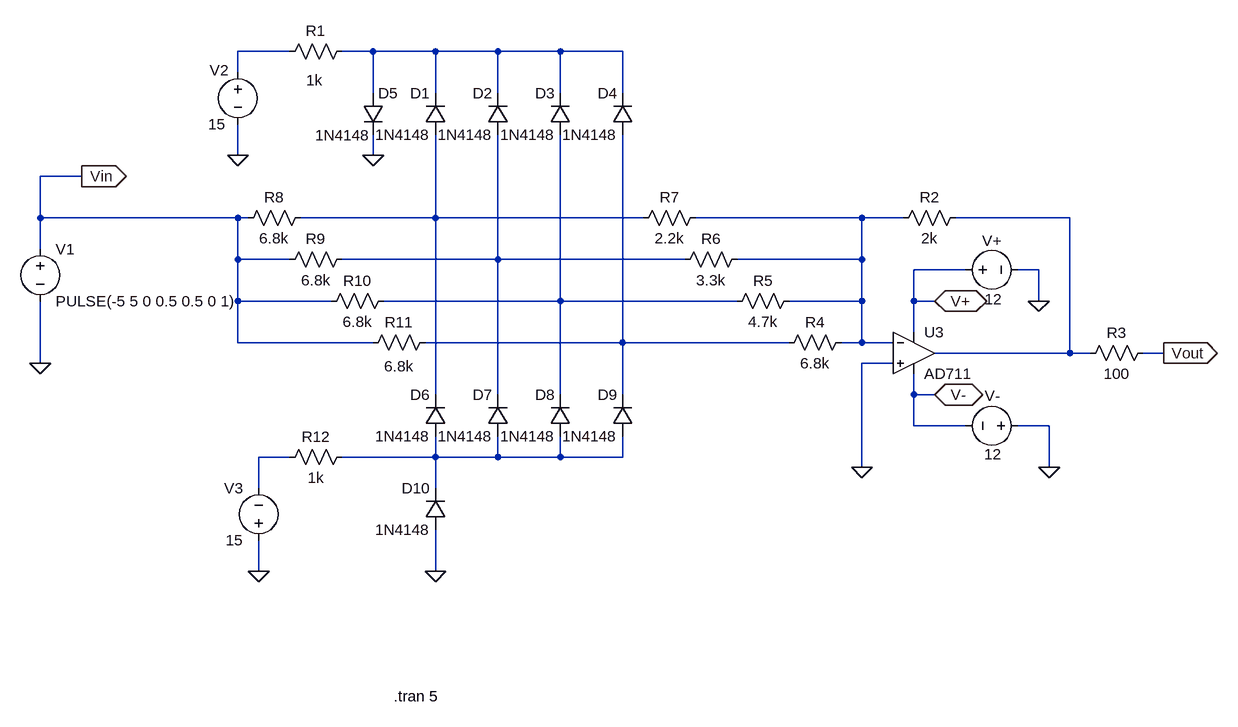
[diagram p0: schematic Ejercicio_3(Conversor_triangular_senoidal).asc]
Ejercicio_3(Conversor_triangular_senoidal).asc, the LTspice schematic file:
Version 4
SHEET 1 1432 776
WIRE -1008 -272 -1088 -272
WIRE -880 -272 -928 -272
WIRE -784 -272 -880 -272
WIRE -688 -272 -784 -272
WIRE -592 -272 -688 -272
WIRE -496 -272 -592 -272
WIRE -1088 -240 -1088 -272
WIRE -880 -208 -880 -272
WIRE -784 -208 -784 -272
WIRE -688 -208 -688 -272
WIRE -592 -208 -592 -272
WIRE -496 -208 -496 -272
WIRE -1088 -112 -1088 -160
WIRE -880 -112 -880 -144
WIRE -1328 -80 -1392 -80
WIRE -1392 -16 -1392 -80
WIRE -1088 -16 -1392 -16
WIRE -1072 -16 -1088 -16
WIRE -784 -16 -784 -144
WIRE -784 -16 -992 -16
WIRE -464 -16 -784 -16
WIRE -128 -16 -384 -16
WIRE -64 -16 -128 -16
WIRE 192 -16 16 -16
WIRE -1392 32 -1392 -16
WIRE -1088 48 -1088 -16
WIRE -1008 48 -1088 48
WIRE -688 48 -688 -144
WIRE -688 48 -928 48
WIRE -400 48 -688 48
WIRE -128 48 -128 -16
WIRE -128 48 -320 48
WIRE 32 64 -48 64
WIRE 144 64 112 64
WIRE -1088 112 -1088 48
WIRE -944 112 -1088 112
WIRE -592 112 -592 -144
WIRE -592 112 -864 112
WIRE -320 112 -592 112
WIRE -128 112 -128 48
WIRE -128 112 -240 112
WIRE -48 112 -48 64
WIRE -16 112 -48 112
WIRE 144 112 144 64
WIRE -48 160 -48 112
WIRE -1088 176 -1088 112
WIRE -880 176 -1088 176
WIRE -496 176 -496 -144
WIRE -496 176 -800 176
WIRE -240 176 -496 176
WIRE -128 176 -128 112
WIRE -128 176 -160 176
WIRE -80 176 -128 176
WIRE 192 192 192 -16
WIRE 192 192 -16 192
WIRE 224 192 192 192
WIRE 336 192 304 192
WIRE -1392 208 -1392 112
WIRE -80 208 -128 208
WIRE -784 256 -784 -16
WIRE -688 256 -688 48
WIRE -592 256 -592 112
WIRE -496 256 -496 176
WIRE -48 256 -48 224
WIRE -16 256 -48 256
WIRE -48 304 -48 256
WIRE 32 304 -48 304
WIRE 160 304 112 304
WIRE -1008 352 -1056 352
WIRE -784 352 -784 320
WIRE -784 352 -928 352
WIRE -688 352 -688 320
WIRE -688 352 -784 352
WIRE -592 352 -592 320
WIRE -592 352 -688 352
WIRE -496 352 -496 320
WIRE -496 352 -592 352
WIRE -128 368 -128 208
WIRE 160 368 160 304
WIRE -1056 400 -1056 352
WIRE -784 400 -784 352
WIRE -1056 528 -1056 480
WIRE -784 528 -784 464
FLAG -1392 208 0
FLAG 144 112 0
FLAG 160 368 0
FLAG 336 192 Vout
IOPIN 336 192 Out
FLAG -128 368 0
FLAG -1328 -80 Vin
IOPIN -1328 -80 Out
FLAG -1088 -112 0
FLAG -1056 528 0
FLAG -880 -112 0
FLAG -784 528 0
FLAG -16 112 V+
IOPIN -16 112 BiDir
FLAG -16 256 V-
IOPIN -16 256 BiDir
SYMBOL res -912 -288 R90
WINDOW 0 0 56 VBottom 2
WINDOW 3 45 58 VTop 2
SYMATTR InstName R1
SYMATTR Value 1k
SYMBOL res 32 -32 R90
WINDOW 0 0 56 VBottom 2
WINDOW 3 32 56 VTop 2
SYMATTR InstName R2
SYMATTR Value 2k
SYMBOL diode -768 -144 R180
WINDOW 0 24 64 Left 2
WINDOW 3 24 0 Left 2
SYMATTR InstName D1
SYMATTR Value 1N4148
SYMBOL diode -672 -144 R180
WINDOW 0 24 64 Left 2
WINDOW 3 24 0 Left 2
SYMATTR InstName D2
SYMATTR Value 1N4148
SYMBOL voltage 16 64 R270
WINDOW 123 0 0 Left 0
WINDOW 39 0 0 Left 0
WINDOW 0 45 41 VRight 2
WINDOW 3 -45 45 VRight 2
SYMATTR InstName V+
SYMATTR Value 12
SYMBOL voltage 128 304 R90
WINDOW 0 -46 43 VRight 2
WINDOW 3 44 41 VRight 2
WINDOW 123 0 0 Left 0
WINDOW 39 0 0 Left 0
SYMATTR InstName V-
SYMATTR Value 12
SYMBOL voltage -1392 16 R0
WINDOW 123 0 0 Left 0
WINDOW 39 0 0 Left 0
SYMATTR InstName V1
SYMATTR Value PULSE(-5 5 0 0.5 0.5 0 1)
SYMBOL res 320 176 R90
WINDOW 0 0 56 VBottom 2
WINDOW 3 32 56 VTop 2
SYMATTR InstName R3
SYMATTR Value 100
SYMBOL res -144 160 R90
WINDOW 0 0 56 VBottom 2
WINDOW 3 32 56 VTop 2
SYMATTR InstName R4
SYMATTR Value 6.8k
SYMBOL res -224 96 R90
WINDOW 0 0 56 VBottom 2
WINDOW 3 32 56 VTop 2
SYMATTR InstName R5
SYMATTR Value 4.7k
SYMBOL res -304 32 R90
WINDOW 0 0 56 VBottom 2
WINDOW 3 32 56 VTop 2
SYMATTR InstName R6
SYMATTR Value 3.3k
SYMBOL res -368 -32 R90
WINDOW 0 0 56 VBottom 2
WINDOW 3 32 56 VTop 2
SYMATTR InstName R7
SYMATTR Value 2.2k
SYMBOL res -976 -32 R90
WINDOW 0 0 56 VBottom 2
WINDOW 3 32 56 VTop 2
SYMATTR InstName R8
SYMATTR Value 6.8k
SYMBOL res -912 32 R90
WINDOW 0 0 56 VBottom 2
WINDOW 3 32 56 VTop 2
SYMATTR InstName R9
SYMATTR Value 6.8k
SYMBOL res -848 96 R90
WINDOW 0 0 56 VBottom 2
WINDOW 3 32 56 VTop 2
SYMATTR InstName R10
SYMATTR Value 6.8k
SYMBOL res -784 160 R90
WINDOW 0 0 56 VBottom 2
WINDOW 3 37 56 VTop 2
SYMATTR InstName R11
SYMATTR Value 6.8k
SYMBOL res -912 336 R90
WINDOW 0 0 56 VBottom 2
WINDOW 3 32 56 VTop 2
SYMATTR InstName R12
SYMATTR Value 1k
SYMBOL voltage -1088 -256 R0
WINDOW 123 0 0 Left 0
WINDOW 39 0 0 Left 0
WINDOW 0 -43 13 Left 2
WINDOW 3 -46 96 Left 2
SYMATTR InstName V2
SYMATTR Value 15
SYMBOL voltage -1056 496 R180
WINDOW 0 24 96 Left 2
WINDOW 3 24 16 Left 2
WINDOW 123 0 0 Left 0
WINDOW 39 0 0 Left 0
SYMATTR InstName V3
SYMATTR Value 15
SYMBOL diode -576 -144 R180
WINDOW 0 24 64 Left 2
WINDOW 3 24 0 Left 2
SYMATTR InstName D3
SYMATTR Value 1N4148
SYMBOL diode -480 -144 R180
WINDOW 0 24 64 Left 2
WINDOW 3 24 0 Left 2
SYMATTR InstName D4
SYMATTR Value 1N4148
SYMBOL diode -896 -208 R0
WINDOW 3 -73 65 Left 2
SYMATTR Value 1N4148
SYMATTR InstName D5
SYMBOL diode -768 320 R180
WINDOW 0 24 64 Left 2
WINDOW 3 24 0 Left 2
SYMATTR InstName D6
SYMATTR Value 1N4148
SYMBOL diode -672 320 R180
WINDOW 0 24 64 Left 2
WINDOW 3 24 0 Left 2
SYMATTR InstName D7
SYMATTR Value 1N4148
SYMBOL diode -576 320 R180
WINDOW 0 24 64 Left 2
WINDOW 3 24 0 Left 2
SYMATTR InstName D8
SYMATTR Value 1N4148
SYMBOL diode -480 320 R180
WINDOW 0 24 64 Left 2
WINDOW 3 24 0 Left 2
SYMATTR InstName D9
SYMATTR Value 1N4148
SYMBOL diode -768 464 R180
WINDOW 0 24 64 Left 2
WINDOW 3 24 0 Left 2
SYMATTR InstName D10
SYMATTR Value 1N4148
SYMBOL OpAmps\\AD711 -48 128 R0
SYMATTR InstName U3
TEXT -848 720 Left 2 !.tran 5

The netlist it stands for:
* Ejercicio_3(Conversor_triangular_senoidal).asc
R1 N002 N001 1k
R2 N005 N004 2k
D1 N003 N002 1N4148
D2 N006 N002 1N4148
V+ V+ 0 12
V- 0 V- 12
V1 Vin 0 PULSE(-5 5 0 0.5 0.5 0 1)
R3 Vout N005 100
R4 N004 N008 6.8k
R5 N004 N007 4.7k
R6 N004 N006 3.3k
R7 N004 N003 2.2k
R8 N003 Vin 6.8k
R9 N006 Vin 6.8k
R10 N007 Vin 6.8k
R11 N008 Vin 6.8k
R12 N010 N009 1k
V2 N001 0 15
V3 0 N009 15
D3 N007 N002 1N4148
D4 N008 N002 1N4148
D5 N002 0 1N4148
D6 N010 N003 1N4148
D7 N010 N006 1N4148
D8 N010 N007 1N4148
D9 N010 N008 1N4148
D10 0 N010 1N4148
XU3 0 N004 V+ V- N005 AD712  ; AD711, pins In+ In- V+ V- OUT
.model D D
.lib standard.dio
.tran 5
.lib ADI1.lib
.backanno
.end